# EAGLE design 14DoF MPU9150 (EAGLE 6.3)
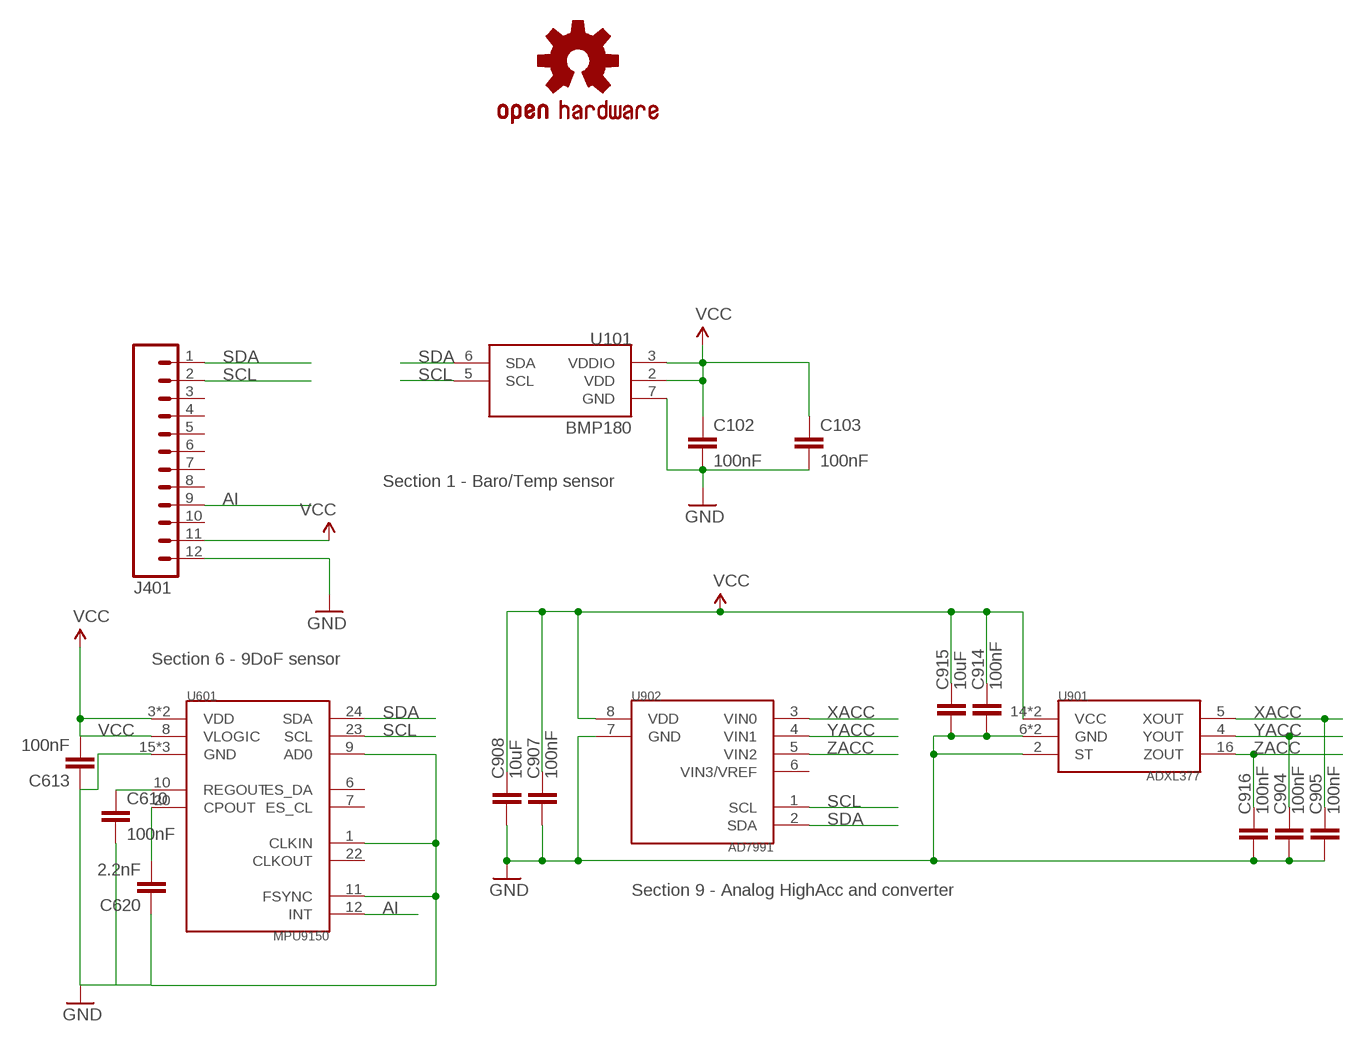
[diagram p0: schematic, sheet 1]

## Parts
C102  100nF  CAP0603-CAP  [0603-CAP]
C103  100nF  CAP0603-CAP  [0603-CAP]
C610  100nF  CAP0603-CAP  [0603-CAP]
C613  100nF  CAP0603-CAP  [0603-CAP]
C620  2.2nF  CAP0603-CAP  [0603-CAP]
C904  100nF  CAP0603-CAP  [0603-CAP]
C905  100nF  CAP0603-CAP  [0603-CAP]
C907  100nF  CAP0603-CAP  [0603-CAP]
C908  10uF  CAP0603-CAP  [0603-CAP]
C914  100nF  CAP0603-CAP  [0603-CAP]
C915  10uF  CAP0603-CAP  [0603-CAP]
C916  100nF  CAP0603-CAP  [0603-CAP]
J401  M12PTH  [1X12]
U101  BMP180  [BMP180]
U601  MPU9150  [LLGA24]
U901  ADXL377  [ADXL377]
U902  AD7991  AD799X  [SOT-23-8]
U$2  OSHW-LOGOS  [OSHW-LOGO-S]

## Nets
AI: J401.9 U601.12(INT)
GND: C102.2 C103.2 C610.2 C613.1 C620.1 C904.2 C905.2 C907.2 C908.2 C914.2 C915.2 C916.2 J401.12 U101.7(GND) U601.1(CLKIN) U601.9(AD0) U601.11(FSYNC) U601.15(GND) U601.17(GND) U601.18(GND) U901.2(ST) U901.6(GND) U901.7(GND) U902.7(GND)
N$1: C610.1 U601.10(REGOUT)
N$3: C620.2 U601.20(CPOUT)
SCL: J401.2 U101.5(SCL) U601.23(SCL) U902.1(SCL)
SDA: J401.1 U101.6(SDA) U601.24(SDA) U902.2(SDA)
VCC [POWER]: C102.1 C103.1 C613.2 C907.1 C908.1 C914.1 C915.1 J401.11 U101.2(VDD) U101.3(VDDIO) U601.3(VDD) U601.8(VLOGIC) U601.13(VDD) U901.14(VCC) U901.15(VCC) U902.8(VDD)
XACC: C905.1 U901.5(XOUT) U902.3(VIN0)
YACC: C904.1 U901.4(YOUT) U902.4(VIN1)
ZACC: C916.1 U901.16(ZOUT) U902.5(VIN2)
Unconnected: J401.3 J401.4 J401.5 J401.6 J401.7 J401.8 J401.10 U601.6(ES_DA) U601.7(ES_CL) U601.22(CLKOUT) U902.6(VIN3/VREF)

## Notes on the sheet
- Section 1 - Baro/Temp sensor
- Section 6 - 9DoF sensor
- Section 9 - Analog HighAcc and converter

## Library data of the parts
C102 C103 C610 C613 C904 C905 C907 C914 C916 = SparkFun:CAP: Capacitor Standard 0603 ceramic capacitor, and 0.1" leaded capacitor.; DIGIKEY: 445-1317-2-ND
C620 = SparkFun:CAP: Capacitor Standard 0603 ceramic capacitor, and 0.1" leaded capacitor.; DIGIKEY: 445-1309-2-ND
C908 C915 = SparkFun:CAP: Capacitor Standard 0603 ceramic capacitor, and 0.1" leaded capacitor.; DIGIKEY: 445-7486-1-ND
J401 = SparkFun:M12: Header 12 Standard 12-pin 0.1" header. Use with straight break away headers (SKU : PRT-00116), right angle break away headers (PRT-00553), swiss pins (PRT-00743), machine pins (PRT-00117), and female headers (PRT-00115).; DIGIKEY: $NOPART
U101 = KwanSystems:BMP180; DIGIKEY: 828-1027-1-ND
U601 = KwanSystems:MPU9150
U901 = KwanSystems:ADXL377; DIGIKEY: ADXL377BCPZ-RL7CT-ND
U902 = KwanSystems:AD799X; DIGIKEY: AD7991YRJZ-0500RL7CT-ND
U$2 = SparkFun:OSHW-LOGO: Open Source Hardware Logo This logo indicates the piece of hardware it is found on incorporates a OSHW license and/or adheres to the definition of open source hardware found here: http://freedomdefined.org/OSHW; DIGIKEY: $NOPART

## Net classes
0 default: width 0.152 mm, drill 0.33 mm, clearance 0.152 mm
1 POWER: width 0.152 mm, drill 0.33 mm, clearance 0.152 mm
2 hv: width 0.152 mm, drill 0.33 mm, clearance 0.152 mm

## Board
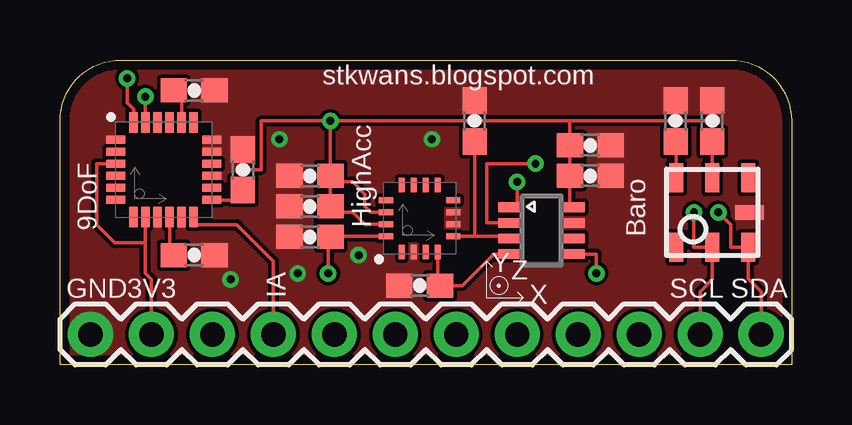
[diagram p1: board, top side]
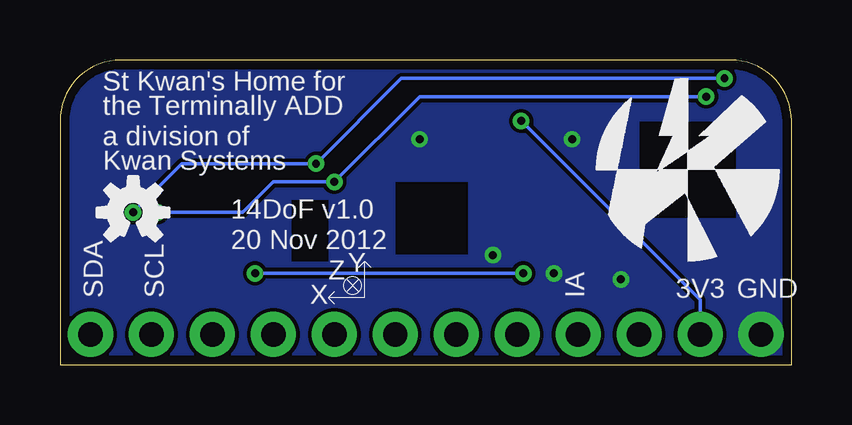
[diagram p2: board, bottom side, seen from below]

Size 30.48 x 12.7 mm. Coordinates in mm from the lower left corner, seen from the top.
Outline: 0,0 0,10.16 arc-90 2.54,12.7 27.94,12.7 arc-90 30.48,10.16 30.48,0 0,0
Copper layers (1*16): Top 0.0356mm / dielectric 1.5011mm / Bottom 0.0356mm
Design rules "default": minimum track width 6mil, minimum drill 13mil, track to track 6mil, track to pad 6mil, pad to pad 6mil, via to via 6mil, smd to smd 6mil, copper to edge 15mil, drill to drill 6mil, minimum pad ring 7mil, minimum via ring 7mil, stop-mask expansion 4mil, vias tented up to drill 14mil, thermal gap 10mil
tRestrict: area 19.3,4.3 to 20.8,6.9
bRestrict: area 19.3,4.3 to 20.8,6.9
vRestrict: area 0.8,2.8 to 1.8,4.8; area 3.3,2.8 to 4.3,4.8; area 5.8,2.8 to 6.9,4.8; area 8.4,2.8 to 9.4,3.8; area 10.9,2.8 to 11.7,5.3; area 12.7,2.8 to 15.2,3.6; area 13.5,3.6 to 14.2,5.3; area 15.5,2.8 to 18,3.6; area 18.5,2.8 to 19.6,3.8; area 20.6,2.8 to 22.6,3.6; area 21.1,3.6 to 21.8,4.8; area 23.6,2.8 to 24.4,3.8; 19 more areas

### Footprints (pad centres in the part's own frame; a part is rotated, then mirrored left to right if it is on the bottom)
0603-CAP = smd 1.1 x 1: 1 -0.85,0; 2 0.85,0
1X12 = drill 1.016 pad 1.88: 1 0,0; 2 2.54,0; 3 5.08,0; 4 7.62,0; 5 10.16,0; 6 12.7,0; 7 15.24,0; 8 17.78,0; 9 20.32,0; 10 22.86,0; 11 25.4,0; 12 27.94,0
BMP180 = smd 0.6 x 1.2: 1 1.5,1.45; 2 0,1.45; 3 -1.5,1.45; 4 -1.5,-1.45; 5 0,-1.45; 6 1.5,-1.45 | smd 1.2 x 0.6: 7 1.55,0
LLGA24 = smd 0.8 x 0.35: 1 -2,1.25; 2 -2,0.75; 3 -2,0.25; 4 -2,-0.25; 5 -2,-0.75; 6 -2,-1.25; 13 2,-1.25; 14 2,-0.75; 15 2,-0.25; 16 2,0.25; 17 2,0.75; 18 2,1.25 | smd 0.35 x 0.85: 7 -1.25,-1.975; 8 -0.75,-1.975; 9 -0.25,-1.975; 10 0.25,-1.975; 11 0.75,-1.975; 12 1.25,-1.975; 19 1.25,1.975; 20 0.75,1.975; 21 0.25,1.975; 22 -0.25,1.975; 23 -0.75,1.975; 24 -1.25,1.975
ADXL377 = smd 0.6 x 0.25: 1 -1.4,0.75; 2 -1.4,0.25; 3 -1.4,-0.25; 4 -1.4,-0.75; 9 1.4,-0.75; 10 1.4,-0.25; 11 1.4,0.25; 12 1.4,0.75 | smd 0.25 x 0.6: 5 -0.75,-1.4; 6 -0.25,-1.4; 7 0.25,-1.4; 8 0.75,-1.4; 13 0.75,1.4; 14 0.25,1.4; 15 -0.25,1.4; 16 -0.75,1.4
SOT-23-8 = smd 0.4 x 1: 1 -0.975,-1.3; 2 -0.325,-1.3; 3 0.325,-1.3; 4 0.975,-1.3; 5 0.975,1.3; 6 0.325,1.3; 7 -0.325,1.3; 8 -0.975,1.3

### Placement (x,y rotation side)
C102  27.18,10.16 90 top
C103  25.65,10.16 90 top
C610  5.59,4.57 0 top
C613  7.62,8.13 270 top
C620  5.59,11.43 180 top
C904  14.99,3.3 180 top
C905  17.27,10.16 90 top
C907  22.1,7.87 0 top
C908  22.1,9.14 0 top
C914  10.41,7.87 180 top
C915  10.41,6.6 180 top
C916  10.41,5.33 180 top
J401  29.21,1.27 180 top
U101  27.18,6.35 0 top
U601  4.32,8.13 0 top
U901  14.99,6.1 90 top
U902  20.07,5.59 270 top
U$1  [KWAN_ACC]  4.32,8.13 0 bottom
U$2  27.43,6.35 0 bottom
U$3  [AXES_SM]  17.78,2.79 0 top

### Tracks (layer width: path | path; a pad name or v marks a point on that pad's centre or on a via)
AI
  Top 0.152: U601.12 5.59,6.13 5.59,5.84 7.37,5.84 8.89,4.32 J401.9
GND  (via drill 0.33)
  other vias: 15.49,9.4 12.45,4.57 9.14,9.4 9.91,3.81 7.11,3.56
  pour Top (no thermals): 2.54,12.7 27.94,12.7 arc-90 30.48,10.16 30.48,0 0,0 0,10.16 arc-90
  pour Bottom (no thermals): 2.54,12.7 27.94,12.7 arc-90 30.48,10.16 30.48,0 0,0 0,10.16 arc-90
N$1
  Top 0.152: U601.10 4.57,4.74 C610.1
N$3
  Top 0.152: U601.20 5.07,11.43 C620.2
SCL  (via drill 0.33)
  Top 0.152: J401.2 26.67,3.05 27.18,3.56 U101.5 26.42,4.9 v26.42,6.35 | v19.05,7.62 19.05,6.56 U902.1 | v3.56,11.18 3.56,10.1 U601.23
  Bottom 0.152: v26.42,6.35 22.86,6.35 21.59,7.62 v19.05,7.62 15.49,11.18 v3.56,11.18
SDA  (via drill 0.33)
  Top 0.152: J401.1 29.21,3.05 28.68,3.58 U101.6 27.94,4.9 27.94,5.84 v27.43,6.35 | v19.81,8.38 17.78,8.38 17.78,5.91 U902.2 | v2.79,11.94 2.79,10.92 3.07,10.65 U601.24
  Bottom 0.152: v27.43,6.35 25.4,8.38 v19.81,8.38 16.26,11.94 v2.79,11.94
VCC  (via drill 0.33)
  Top 0.152: U101.2 C102.1 27.18,10.16 25.65,10.16 | U101.3 25.68,9.29 C103.1 25.65,10.16 | U901.15 12.7,5.85 12.19,6.35 11.52,6.35 C915.1 C914.1 | C914.1 11.52,7.62 12.19,7.62 12.7,7.11 12.7,6.6 12.96,6.35 U901.14 | 25.65,10.16 21.25,10.16 | 21.25,10.16 v11.26,10.16 | J401.11 3.81,3.56 3.56,3.81 3.56,5.08 | 3.56,5.08 3.56,6.14 U601.8 | 3.56,5.08 2.29,5.08 1.52,5.84 1.52,8.38 U601.3 | U902.8 21.25,6.68 C907.1 C908.1 21.25,10.16 | C914.1 v11.26,10.16 | v11.26,10.16 8.38,10.16 8.38,8.13 7.62,8.13 C613.2 7.62,6.86 6.32,6.86 U601.13
  Bottom 0.152: J401.11 3.81,2.71 v11.26,10.16
XACC
  Top 0.152: C905.1 17.27,5.35 | 17.27,5.35 U901.5 | 17.27,5.35 18.77,5.35 U902.3
YACC
  Top 0.152: U901.4 15.74,3.4 C904.1 16.76,3.3 18.07,4.61 U902.4
ZACC  (via drill 0.33)
  Top 0.152: U901.16 11.26,5.35 C916.1 arc90 11.18,5.25 v11.18,3.81 | v22.35,3.81 22.35,4.61 U902.5
  Bottom 0.152: v11.18,3.81 v22.35,3.81

### Text on the board
tPlace: stkwans.blogspot.com | 9DoF | HighAcc | Baro | GND | 3V3 | IA | SCL | SDA
bPlace: St Kwan's Home for | the Terminally ADD | a division of | Kwan Systems | 14DoF v1.0 | 20 Nov 2012 | GND | 3V3 | IA | SCL | SDA